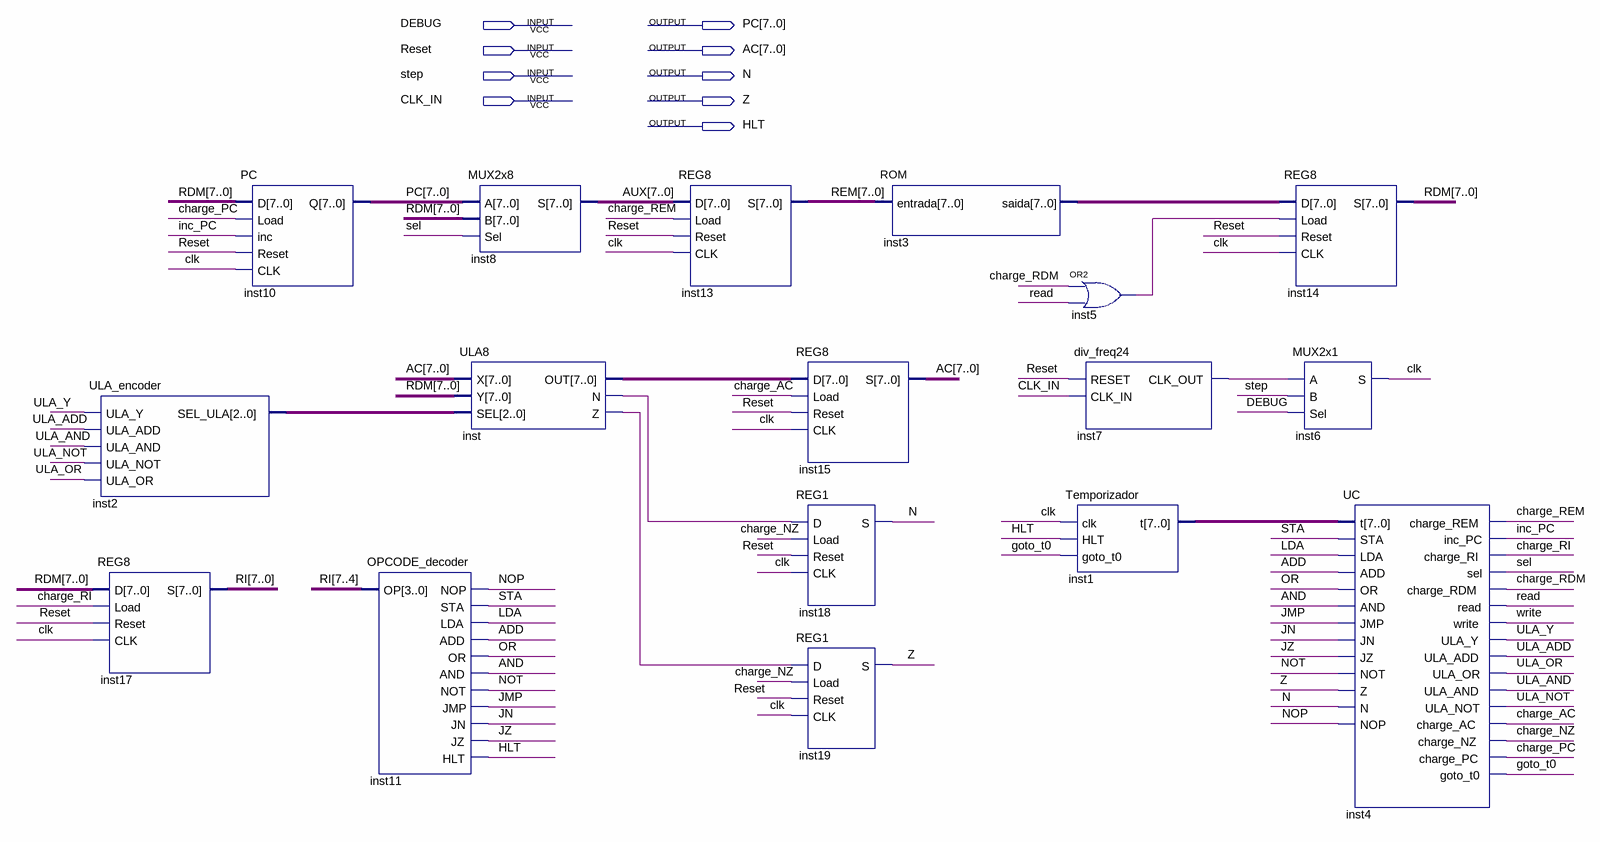
[diagram p0: schematic sheet]
// Quartus schematic NEANDER.bdf as structural Verilog: 17 symbols, 9 pins
module NEANDER (
  input  DEBUG,
  input  Reset,
  input  step,
  input  CLK_IN,
  output [7:0] PC,
  output [7:0] AC,
  output N,
  output Z,
  output HLT
);

  wire ADD, AND, charge_AC, charge_NZ, charge_PC, charge_RDM, charge_REM, charge_RI, clk, goto_t0, inc_PC,
       inst5_out, inst7_clk_out, inst_n, inst_z, JMP, JN, JZ, LDA, NOP, NOT, OR, read, sel, STA, ULA_ADD,
       ULA_AND, ULA_NOT, ULA_OR, ULA_Y, write;
  wire [2:0] inst2_sel_ula;
  wire [7:0] AUX, inst1_t, inst3_saida, inst_out, RDM, REM, RI;

  ULA_encoder inst2 (
    .ULA_Y(ULA_Y), .ULA_ADD(ULA_ADD), .ULA_AND(ULA_AND), .ULA_NOT(ULA_NOT), .ULA_OR(ULA_OR),
    .SEL_ULA(inst2_sel_ula));
  REG8 inst17 (.D(RDM), .Load(charge_RI), .Reset(Reset), .CLK(clk), .S(RI));
  PC inst10 (.D(RDM), .Load(charge_PC), .inc(inc_PC), .Reset(Reset), .CLK(clk), .Q(PC));
  OPCODE_decoder inst11 (
    .OP(RI[7:4]), .NOP(NOP), .STA(STA), .LDA(LDA), .ADD(ADD), .OR(OR), .AND(AND), .NOT(NOT), .JMP(JMP),
    .JN(JN), .JZ(JZ), .HLT(HLT));
  MUX2x8 inst8 (.A(PC), .B(RDM), .Sel(sel), .S(AUX));
  ULA8 inst (.X(AC), .Y(RDM), .SEL(inst2_sel_ula), .OUT(inst_out), .N(inst_n), .Z(inst_z));
  REG8 inst13 (.D(AUX), .Load(charge_REM), .Reset(Reset), .CLK(clk), .S(REM));
  REG8 inst15 (.D(inst_out), .Load(charge_AC), .Reset(Reset), .CLK(clk), .S(AC));
  REG1 inst18 (.D(inst_n), .Load(charge_NZ), .Reset(Reset), .CLK(clk), .S(N));
  REG1 inst19 (.D(inst_z), .Load(charge_NZ), .Reset(Reset), .CLK(clk), .S(Z));
  ROM inst3 (.entrada(REM), .saida(inst3_saida));
  or inst5 (inst5_out, charge_RDM, read);
  div_freq24 inst7 (.RESET(Reset), .CLK_IN(CLK_IN), .CLK_OUT(inst7_clk_out));
  Temporizador inst1 (.clk(clk), .HLT(HLT), .goto_t0(goto_t0), .t(inst1_t));
  REG8 inst14 (.D(inst3_saida), .Load(inst5_out), .Reset(Reset), .CLK(clk), .S(RDM));
  MUX2x1 inst6 (.A(inst7_clk_out), .B(step), .Sel(DEBUG), .S(clk));
  UC inst4 (
    .t(inst1_t), .STA(STA), .LDA(LDA), .ADD(ADD), .OR(OR), .AND(AND), .JMP(JMP), .JN(JN), .JZ(JZ), .NOT(NOT),
    .Z(Z), .N(N), .NOP(NOP), .charge_REM(charge_REM), .inc_PC(inc_PC), .charge_RI(charge_RI), .sel(sel),
    .charge_RDM(charge_RDM), .read(read), .write(write), .ULA_Y(ULA_Y), .ULA_ADD(ULA_ADD), .ULA_OR(ULA_OR),
    .ULA_AND(ULA_AND), .ULA_NOT(ULA_NOT), .charge_AC(charge_AC), .charge_NZ(charge_NZ),
    .charge_PC(charge_PC), .goto_t0(goto_t0));
endmodule
